# Altium schematic sheet 13-Experimental.SchDoc
size B; SheetNumber: 10; SheetTotal: 17
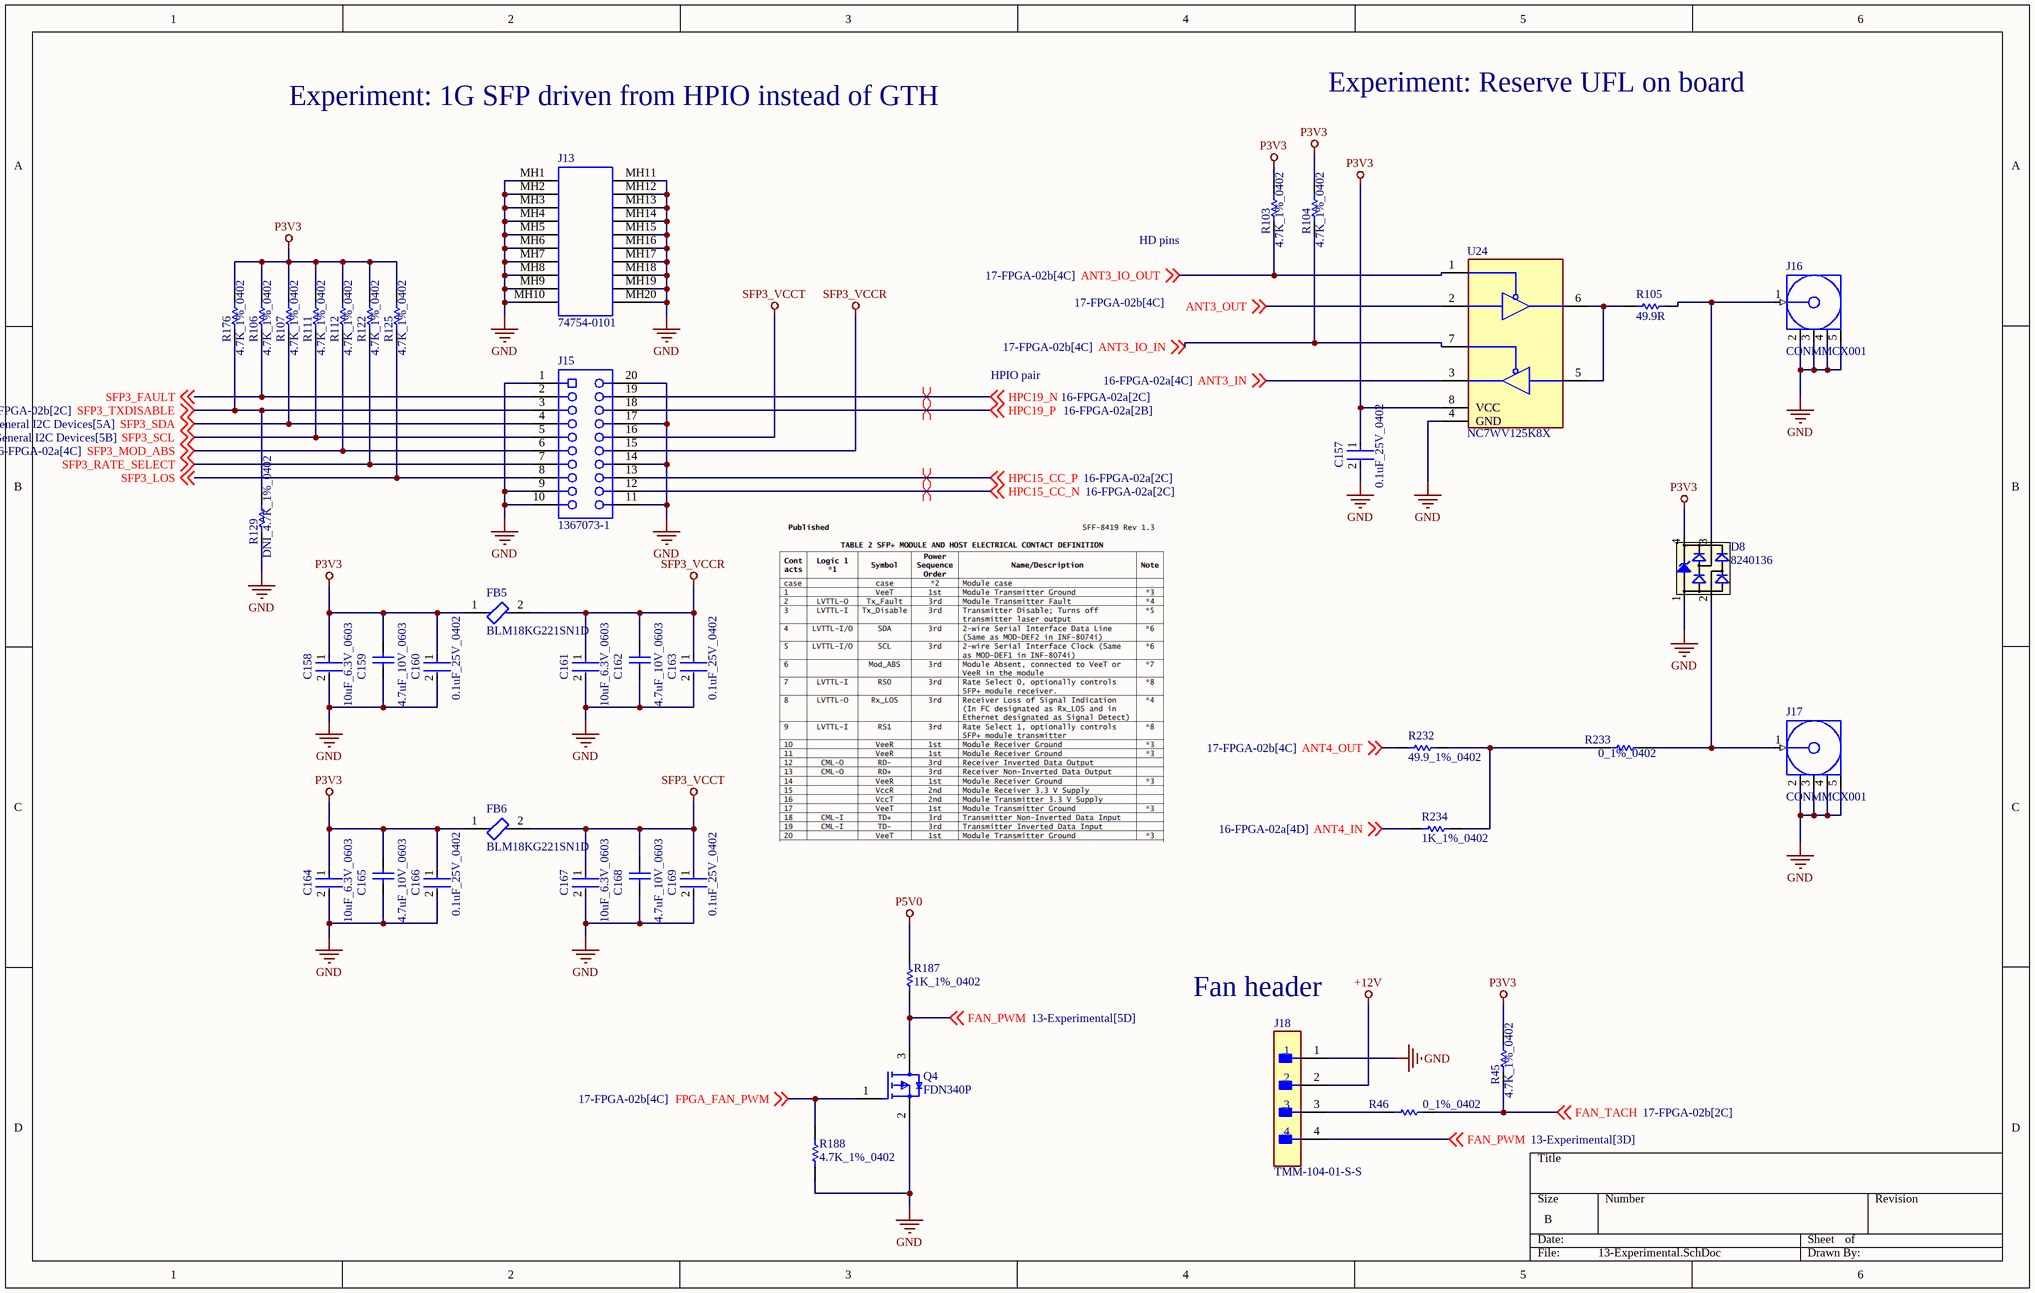
[diagram p0: 13-Experimental.SchDoc]

## Parts
C157  0.1uF_25V_0402  [FP-0402-L_1_0_1-W_0_5_0_1-IPC_C]
C158  10uF_6.3V_0603  [FP-C0603C106M9PACTU-MFG]
C159  4.7uF_10V_0603  [CAPC1608X87X35NL15T15]
C160  0.1uF_25V_0402  [FP-0402-L_1_0_1-W_0_5_0_1-IPC_C]
C161  10uF_6.3V_0603  [FP-C0603C106M9PACTU-MFG]
C162  4.7uF_10V_0603  [CAPC1608X87X35NL15T15]
C163  0.1uF_25V_0402  [FP-0402-L_1_0_1-W_0_5_0_1-IPC_C]
C164  10uF_6.3V_0603  [FP-C0603C106M9PACTU-MFG]
C165  4.7uF_10V_0603  [CAPC1608X87X35NL15T15]
C166  0.1uF_25V_0402  [FP-0402-L_1_0_1-W_0_5_0_1-IPC_C]
C167  10uF_6.3V_0603  [FP-C0603C106M9PACTU-MFG]
C168  4.7uF_10V_0603  [CAPC1608X87X35NL15T15]
C169  0.1uF_25V_0402  [FP-0402-L_1_0_1-W_0_5_0_1-IPC_C]
D8  8240136  [SOT143-4L]
FB5  BLM18KG221SN1D  [FP-BLM18-0_15-t0_8-IPC_B]
FB6  BLM18KG221SN1D  [FP-BLM18-0_15-t0_8-IPC_B]
J13  74754-0101  [MOLX-74754-0101_V]
J15  1367073-1  [TECO-1367073-1_V]
J16  CONMMCX001  [CON-MMCX]
J17  CONMMCX001  [CON-MMCX]
J18  TMM-104-01-S-S  [FP-TMM-104-01-S-S-MFG]
Q4  FDN340P  [FP-527AG-MFG]
R45  4.7K_1%_0402  [RESC1005X40X25NL10T10]
R46  0_1%_0402  [RESC1005X40X25LL05T05]
R103  4.7K_1%_0402  [RESC1005X40X25NL10T10]
R104  4.7K_1%_0402  [RESC1005X40X25NL10T10]
R105  49.9R  [RESC1608X55X25NL10T15]
R106  4.7K_1%_0402  [RESC1005X40X25NL10T10]
R107  4.7K_1%_0402  [RESC1005X40X25NL10T10]
R111  4.7K_1%_0402  [RESC1005X40X25NL10T10]
R112  4.7K_1%_0402  [RESC1005X40X25NL10T10]
R122  4.7K_1%_0402  [RESC1005X40X25NL10T10]
R125  4.7K_1%_0402  [RESC1005X40X25NL10T10]
R129  DNI_4.7K_1%_0402  [RESC1005X40X25NL10T10]  (no BOM)
R176  4.7K_1%_0402  [RESC1005X40X25NL10T10]
R187  1K_1%_0402  [RESC1005X40X25NL05T05]
R188  4.7K_1%_0402  [RESC1005X40X25NL10T10]
R232  49.9_1%_0402  [RESC1005X40X25NL10T10]
R233  0_1%_0402  [RESC1005X40X25LL05T05]
R234  1K_1%_0402  [RESC1005X40X25NL05T05]
U24  NC7WV125K8X  [SOP50P310X90-8N]

## Nets
+12V: J18.2
GND: C157.2 C158.2 C159.1 C160.2 C161.2 C162.1 C163.2 C164.2 C165.1 C166.2 C167.2 C168.1 C169.2 D8.1(GND) J13.MH1 J13.MH2 J13.MH3 J13.MH4 J13.MH5 J13.MH6 J13.MH7 J13.MH8 J13.MH9 J13.MH10 J13.MH11 J13.MH12 J13.MH13 J13.MH14 J13.MH15 J13.MH16 J13.MH17 J13.MH18 J13.MH19 J13.MH20 J15.1 J15.9 J15.10 J15.11 J15.14 J15.17 J15.20 J16.2(GND) J16.3(GND) J16.4(GND) J16.5(GND) J17.2(GND) J17.3(GND) J17.4(GND) J17.5(GND) J18.1 Q4.2(S) R129.2 R188.1 U24.4(GND)
P3V3: C157.1 C158.1 C159.2 C160.1 C164.1 C165.2 C166.1 D8.4(VDD) FB5.1 FB6.1 R45.1 R103.1 R104.1 R106.1 R107.1 R111.1 R112.1 R122.1 R125.1 R176.1 U24.8(VCC)
P5V0: R187.2
SFP3_VCCR: C161.1 C162.2 C163.1 FB5.2 J15.15
SFP3_VCCT: C167.1 C168.2 C169.1 FB6.2 J15.16
ANT3_IN: U24.3 ; off-sheet ANT3_IN
ANT3_IO_IN: R104.2 U24.7 ; off-sheet ANT3_IO_IN
ANT3_IO_OUT: R103.2 U24.1 ; off-sheet ANT3_IO_OUT
ANT3_OUT: U24.2 ; off-sheet ANT3_OUT
ANT4_IN: R234.1 ; off-sheet ANT4_IN
ANT4_OUT: R232.1 ; off-sheet ANT4_OUT
FAN_PWM: J18.4 Q4.3(D) R187.1 ; off-sheet FAN_PWM
FAN_TACH: R45.2 R46.2 ; off-sheet FAN_TACH
FPGA_FAN_PWM: Q4.1(G) R188.2 ; off-sheet FPGA_FAN_PWM
HPC15_CC_N: J15.12 ; off-sheet HPC15_CC_N
HPC15_CC_P: J15.13 ; off-sheet HPC15_CC_P
HPC19_N: J15.19 ; off-sheet HPC19_N
HPC19_P: J15.18 ; off-sheet HPC19_P
SFP3_FAULT: J15.2 R106.2 ; off-sheet SFP3_FAULT
SFP3_LOS: J15.8 R125.2 ; off-sheet SFP3_LOS
SFP3_MOD_ABS: J15.6 R112.2 ; off-sheet SFP3_MOD_ABS
SFP3_RATE_SELECT: J15.7 R122.2 ; off-sheet SFP3_RATE_SELECT
SFP3_SCL: J15.5 R111.2 ; off-sheet SFP3_SCL
SFP3_SDA: J15.4 R107.2 ; off-sheet SFP3_SDA
SFP3_TXDISABLE: J15.3 R129.1 R176.2 ; off-sheet SFP3_TXDISABLE
NetD8_2: D8.2(I/O1) J17.1(Signal) R233.2
NetD8_3: D8.3(I/O2) J16.1(Signal) R105.2
NetJ18_3: J18.3 R46.1
NetR105_1: R105.1 U24.5 U24.6
NetR232_2: R232.2 R233.1 R234.2

## Layout directives
differential pair: HPC15_CC_N, HPC15_CC_P, HPC19_N, HPC19_P

## Notes on the sheet
- Experiment: Reserve UFL on board
- Experiment: 1G SFP driven from HPIO instead of GTH
- HD pins
- HPIO pair
- Fan header

## Library data of the parts
C157 C160 C163 C166 C169 = CMP-2008-02519-2: General Purpose Ceramic Capacitor, 0402, 100nF, 10%, X7R, 15%, 25V; Package Quantity: 1; Capacitance: 100nF; Min Operating Temperature: -55°C; Voltage: 25V; Voltage Rating: 25V; Construction: Flat; Max Operating Temperature: 125°C; Radiation Hardening: No; Depth: 0.5mm; Thickness: 0.022inch; Voltage Rating (DC): 25V; Number of Pins: 2; Lead Free: Lead Free; Series: -; REACH SVHC: No SVHC; Length: 1mm; Dielectric: X7R; RoHS Compliant: Yes; Mount: Surface Mount; Packaging: Tape and Reel; Case/Package: 0402; Case Code (Imperial): 0402; Termination: SMD/SMT; Width: 0.02inch; Case Code (Metric): 1005; Tolerance: 10%
C158 C161 C164 C167 = CMP-2006-02285-3: CAP CER 10UF 6.3V X5R 0603; Manufacturer Part Number: C0603C106M9PACTU; Manufacturer: Kemet; Material: Ceramic; Temperature Coefficient: 15%; Tolerance: 20%; Category: Cap; Height: 0.9mm; Digikey Description: CAP CER 10UF 6.3V X5R 0603; Mouser Description: In a Pack of 10, KEMET 0603 (1608M) 10µF MLCC 6.3V dc ±20% SMD C0603C106M9PACTU; Voltage Rating: 6.3V; Device Class L2: Capacitors; Temperature Range Low: -55°C; Temperature Characteristic: X5R; ComponentLink2Description: Datasheet; Ipc Land Pattern Name: CAPC16080X80; ComponentLink2URL: http://www.kemet.com/Lists/ProductCatalog/Attachments/19/KEM_C1006_X5R_SMD.pdf; Capacitance: 10uF; Temperature Range High: +85°C; Device Class L3: Ceramic Capacitors; RoHS: TRUE; Automotive: No; Value: 10uF; Temperature: -55°C to +85°C; Device Class L1: Passive Components; Package: C0603C106M9PACTU; Lead Free: Yes; Octopart: https://octopart.com/c0603c106m9pactu-kemet-8375727
C159 C162 C165 C168 = CMP-2006-03238-1: Part Number: C0603C475K8PACTU; Manufacturer: Kemet
D8 = CMP-1486-00002-1: TVS Diode WE-TVS-HS, VRWM=3.3V; Manufacturer: Wuerth Elektronik; Reverse Stand Off Voltage: 3.3V; PartNumber: 8240136; ComponentLink1Description: Manufacturer URL; PackageReference: SOT143-4L; ComponentLink1URL: http://www.we-online.com; ComponentLink2Description: Datasheet; ComponentLink2URL: http://katalog.we-online.de/kataloge/eisos/media/pdf/8240136.pdf
FB5 FB6 = CMP-0686-00556-7: Chip Ferrite Bead, 0603, 220Ω @ 100MHz, 0.05Ω, 25%, 2.2A; DC Resistance (DCR): 50mR; Number of Circuits: 1; Impedance: 220R; Current Rating: 2.2A; Material: Ferrite; Test Frequency: 100MHz; Depth: 0.8mm; Series: BLM18K; RoHS Compliant: Yes; Termination: SMD/SMT; Max Current Rating: 2.2A; Case Code (Metric): 1608; Radiation Hardening: No; Number of Pins: 2; Length: 1.6mm; Lead Free: Lead Free; Package Quantity: 1; Height: 0.8mm; Core Material: Ferrite; Inductor Type: FERRITE BEAD; Min Operating Temperature: -55°C; Case/Package: 0603; Case Code (Imperial): 0603; Number of Lines: 1; Packaging: Tape and Reel; REACH SVHC: No SVHC; Max Operating Temperature: 125°C; Military Standard: Not; DC Resistance-Max: 50mR; Width: 0.8mm; DC Current: 2.2A; Max DC Current: 2.2A; Tolerance: 25%; Weight: 7.1E-05oz
J13 = CMP-1704-00003-3: SFP+ Cage, Single Port, Height 10.85 mm, Tail Height 3.05 mm, -40 to 85 degC, RoHS, Tray; RoHSCompliant: True; ComponentLink3URL: http://www.molex.com/pdm_docs/sd/747540101_sd.pdf; Width: 49 mm; Height: 10.85 mm; Mounting Technology: Through Hole; ComponentLink2Description: Datasheet; ComponentLink3Description: Package Specification; DatasheetVersion: Rev. Jul-15; Package Quantity: 1152; PackageDescription: SFP+ Cage, Single Port, Height 10.85 mm, Tail Height 3.05 mm; Radiation Hardening: No; PackageVersion: Rev. J, 02/2015; ComponentLink1Description: Manufacturer URL; PartNumber: 74754-0101; ComponentLink1URL: http://www.molex.com/; Packaging: Tray; Length: 15.9 mm; ComponentLink2URL: http://www.molex.com/webdocs/datasheets/pdf/en-us/0747540101_IO_CONNECTORS.pdf
J15 = CMP-2000-05488-1: Female Connector, Pitch 0.8 mm, 2 x 10 Position, Height 5.4 mm, -55 to 85 degC, RoHS, Tape and Reel; Manufacturer: TE Connectivity; Product Training Modules: HighSpeedPluggableI/OSolutions; 3D Model: 1367073-1.pdf; Connector Type: SFP; Other Names: A97430DKR; Mating Products: 516-2084-ND / -TXRXOPTICALSFF1.25GBDISCSI; Dynamic Catalog: SFPConnectors; Featured Product: HighSpeedPluggableI-OSolutions; Connector Style: Receptacle; Associated Product: A103997CT-ND / -CONNSFPCAGESINGLEW/OPIPE / A103997TR-ND / -CONNSFPCAGESINGLEW/OPIPE / 1367645-3-ND / -CONNCAGE&HEATSINKSGLPORTTIN / 1367645-2-ND / -CONNCAGE&HEATSINKSGLPORTTIN / 1888424-1-ND / -CONNCAGE1X2SFPENHANCEDEMI / 1367643-1-ND / -CONNCAGESNGLPORTDBLSIDETIN / 1489962-1-ND / -CONNSFPCAGESINGLEW/OPIPE / 1367645-1-ND / -CONNCAGE&HEATSINKSGLPORTTIN / A99375-ND / -CONNSFPCAGE1X4PIN-IN-PASTE / A97412CT-ND / -CONNSFPLOWERCAGEPCB / More...; Number of Positions: 20; Package Reference: 1367073-1; Package Description: Female Connector, Pitch 0.8 mm, 2 x 10 Position, Height 5.4 mm; RoHS Information: 1367073-1StatementofCompliance; Contact Finish: Gold; Datasheet URL: http://www.te.com/commerce/DocumentDelivery/DDEController?Action=showdoc&DocId=Customer+Drawing%7F1367073%7FK%7Fpdf%7FEnglish%7FENG_CD_1367073_K.pdf%7F1367073-1; Datasheet Version: Rev. K, 12/2012; Contact Finish Thickness: 15µin(0.38µm); Category: Connectors,Interconnects; Mounting Type: SurfaceMount,RightAngle; Mounting Technology: SurfaceMount; Packaging: Digi-Reel®; Manufacturer URL: http://www.te.com/; Family: PluggableConnectors; Standard Package: 1; Termination: Solder
J16 J17 = CMP-0168-00018-1: MMCX Female PCB Mount Connector, Thru-Hole; PCB_Layout: Pads complies with manufacturer's recommendation.; PackageReference: CON-MMCX; PackageDescription: MMCX Female PCB Mount Connector, Thru-Hole, 3.5 x 3.5 mm Body; DatasheetVersion: rev1.0, Jun-2006; PackageVersion: rev1.0, Jun-2006
J18 = CMP-02766-001674-1: CONN HEADER VERT 4POS 2MM; Max Current Rating: 3.9A; Connector Type: Male Pin; Max Voltage Rating (AC): 500V; Number of Contacts: 4; Gender: Male; Color: Black; Packaging: Bulk; Orientation: Straight; Contact Mating Length: 0.126inch; Contact Plating: Gold; Max Operating Temperature: 125°C; Housing Color: Black; Contact Material: Bronze; Package Quantity: 1; Housing Material: Polymer; Radiation Hardening: No; Pitch: 2mm; Contact Type: Male Pin; Number of Positions: 4; Number of Rows: 1; Lead Free: Lead Free; Width: 1.97mm; Termination: Solder; Depth: 1.97mm; Series: FleXYZ™ TMM; RoHS Compliant: Yes; Length: 8mm; Min Operating Temperature: -55°C; Mount: Through Hole
Q4 = CMP-2100-03638-2: MOSFET P-CH 20V 2A SSOT3; Fall Time: 11ns; Rise Time: 9ns; Voltage Rating (DC): -20V; Power Dissipation: 500mW; Nominal Vgs: -800mV; Current Rating: -2A; Gate to Source Voltage (Vgs): 8V; Rds On Max: 70mR; Turn-Off Delay Time: 27ns; Element Configuration: Single; Number of Elements: 1; Input Capacitance: 779pF; Drain to Source Resistance: 60mR; Turn-On Delay Time: 10ns; Package Quantity: 1; Mount: Surface Mount; Case/Package: SOT-23; Min Operating Temperature: -55°C; REACH SVHC: No SVHC; Weight: 0.03g; Packaging: Tape and Reel; Threshold Voltage: -800mV; Max Operating Temperature: 150°C; Dual Supply Voltage: -20V; Termination: SMD/SMT; Drain to Source Voltage (Vdss): 20V; Height: 0.94mm; Length: 2.92mm; Contact Plating: Tin; Width: 3.05mm; Drain to Source Breakdown Voltage: -20V; Max Power Dissipation: 500mW; Continuous Drain Current (ID): 2A; Number of Pins: 3; Lead Free: Lead Free; Radiation Hardening: No; On-State Resistance: 70MR
R45 R103 R104 R106 R107 R111 R112 R122 R125 R129 R176 R188 = CMP-2002-05217-1: Manufacturer: Bourns; Part Number: CR0402-FX-4701GLF
R46 R233 = CMP-2000-07451-1: Chip Resistor, 0 Ohm, 0.1 W, -55 to 155 degC, 0402 (1005 Metric), RoHS, Tape and Reel; Manufacturer: Panasonic; Voltage Rating (DC): 50V; Temperature Coefficient: 600ppm/��C; Max Power Dissipation: 100mW; Resistance: 0mOhm; Tolerance: 5%; Number of Terminations: 2; Mount: SurfaceMount; Height: 0.35mm; Packaging: TapeandReel; Contact Plating: Tin; Manufacturer URL: http://www.panasonic.com/; Composition: ThickFilm; Max Operating Temperature: 155degC; REACH SVHC: NoSVHC; Case/Package: 0402; Package Reference: 402; Depth: 0.5mm; Package Description: 2-Pin Surface Mount Device, Body 1 x 0.5 mm; Datasheet URL: https://industrial.panasonic.com/cdbs/www-data/pdf/RDA0000/AOA0000C301.pdf; RoHSCompliant: True; Case Code (Imperial): 0402; Military Standard: Not; Min Operating Temperature: -55degC; Power Rating: 100mW; Datasheet Version: 03/2015; Length: 1mm; Case Code (Metric): 1005; Termination: SMD/SMT; Mounting Technology: SurfaceMount; Voltage Rating: 50V; Width: 0.02inch; Package Quantity: 1; Lead Free: LeadFree; Radiation Hardening: No
R105 = CMP-1659-00036-1: General Purpose Chip Resistor, 49.9 Ohm, +/- 1%, -55 to 155 degC, 0603 (1608 Metric), RoHS, Tape and Reel; Max Supply Voltage: 3.63 V; Case\Package: LQFP; Interface: SPI; Min Supply Voltage: 2.97 V; PackageReference: 0603; Packaging: Tray; ComponentLink2Description: Datasheet; ComponentLink1Description: Manufacturer URL; ComponentLink2URL: https://datasheet.ciiva.com/11808/0900766b80f96399-11808223.pdf; RoHSCompliant: true; Max Operating Temperature: 85 degC; ComponentLink1URL: http://www.yageo.com/; PackageDescription: 2-Pin Surface Mount Device, Body 1.6 x 0.8 mm; DatasheetVersion: Rev. 4, 04/2009; Min Operating Temperature: -40 degC; Package Quantity: 250; Pins: 48
R187 R234 = CMP-2002-08277-1: Manufacturer: Vishay Dale; Part Number: CRCW04021K00FKTD
R232 = CMP-2002-04448-1: Part Number: RK73H1ETTP49R9F; Manufacturer: KOA Speer
U24 = NC7WV125K8X: Integrated Circuit; Manufacturer_Name: ON Semiconductor; Datasheet Link: https://www.mouser.com/datasheet/2/308/NC7WV125-1301459.pdf; Height: 0.9mm; Manufacturer_Part_Number: NC7WV125K8X; Mouser Part Number: 512-NC7WV125K8X; Mouser Price/Stock: https://www.mouser.com/Search/Refine.aspx?Keyword=512-NC7WV125K8X; Arrow Part Number: NC7WV125K8X; Arrow Price/Stock: https://www.arrow.com/en/products/nc7wv125k8x/on-semiconductor